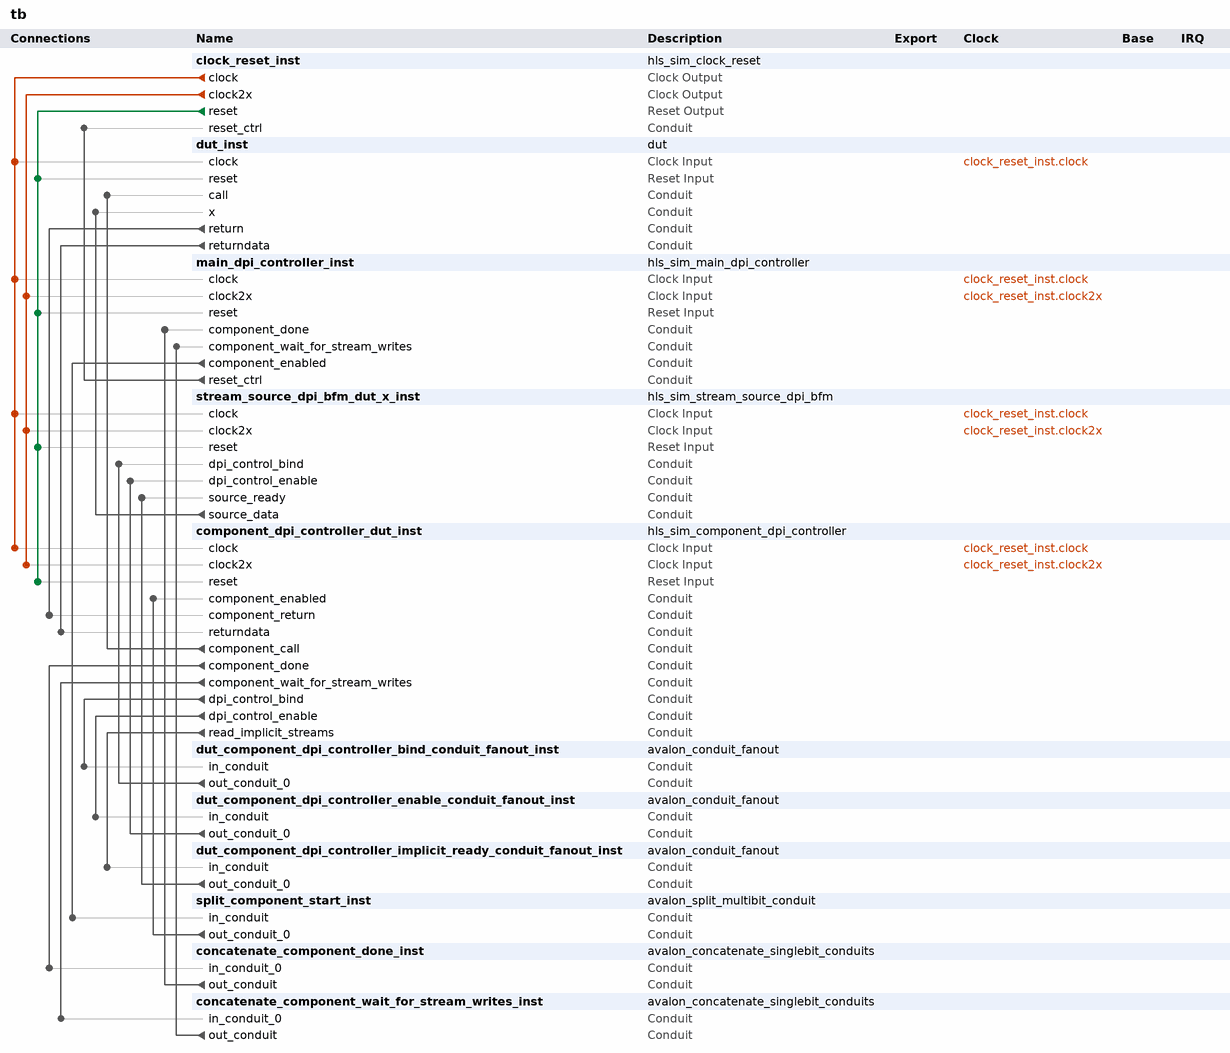
[diagram p0: system contents]
# Platform Designer (Qsys) system tb, Cyclone V 5CGXFC3B6F23C6
# Parameters at their usual value, and those the tool derives, are not listed.
package require qsys
create_system tb
set_project_property DEVICE_FAMILY {Cyclone V}
set_project_property DEVICE 5CGXFC3B6F23C6

add_instance clock_reset_inst hls_sim_clock_reset 1.0
set_instance_parameter_value clock_reset_inst RESET_CYCLE_HOLD 4

add_instance dut_inst dut 1.0

add_instance main_dpi_controller_inst hls_sim_main_dpi_controller 1.0
set_instance_parameter_value main_dpi_controller_inst COMPONENT_NAMES_STR dut
set_instance_parameter_value main_dpi_controller_inst NUM_COMPONENTS 1

add_instance stream_source_dpi_bfm_dut_x_inst hls_sim_stream_source_dpi_bfm 1.0
set_instance_parameter_value stream_source_dpi_bfm_dut_x_inst COMPONENT_NAME dut
set_instance_parameter_value stream_source_dpi_bfm_dut_x_inst EMPTY_WIDTH 0
set_instance_parameter_value stream_source_dpi_bfm_dut_x_inst FIRST_SYMBOL_IN_HIGH_ORDER_BITS 0
set_instance_parameter_value stream_source_dpi_bfm_dut_x_inst FORCE_STREAM_CONDUIT 1
set_instance_parameter_value stream_source_dpi_bfm_dut_x_inst INTERFACE_NAME x
set_instance_parameter_value stream_source_dpi_bfm_dut_x_inst STREAM_BITSPERSYMBOL 1
set_instance_parameter_value stream_source_dpi_bfm_dut_x_inst STREAM_DATAWIDTH 16
set_instance_parameter_value stream_source_dpi_bfm_dut_x_inst USES_PACKETS 0

add_instance component_dpi_controller_dut_inst hls_sim_component_dpi_controller 1.0
set_instance_parameter_value component_dpi_controller_dut_inst COMPONENT_HAS_AGENT_RETURN 0
set_instance_parameter_value component_dpi_controller_dut_inst COMPONENT_MANGLED_NAME "\\3fdut@@YA\\3fAV\\3f\$ac_fixed@\$0BA@\$07\$00\$0A@\$0A@@@V1@@Z"
set_instance_parameter_value component_dpi_controller_dut_inst COMPONENT_NAME dut
set_instance_parameter_value component_dpi_controller_dut_inst COMPONENT_NUM_AGENTS 0
set_instance_parameter_value component_dpi_controller_dut_inst COMPONENT_NUM_OUTPUT_STREAMS 0
set_instance_parameter_value component_dpi_controller_dut_inst RETURN_DATAWIDTH 16

add_instance dut_component_dpi_controller_bind_conduit_fanout_inst avalon_conduit_fanout 1.0
set_instance_parameter_value dut_component_dpi_controller_bind_conduit_fanout_inst numFanOut 1

add_instance dut_component_dpi_controller_enable_conduit_fanout_inst avalon_conduit_fanout 1.0
set_instance_parameter_value dut_component_dpi_controller_enable_conduit_fanout_inst numFanOut 1

add_instance dut_component_dpi_controller_implicit_ready_conduit_fanout_inst avalon_conduit_fanout 1.0
set_instance_parameter_value dut_component_dpi_controller_implicit_ready_conduit_fanout_inst numFanOut 1

add_instance split_component_start_inst avalon_split_multibit_conduit 1.0
set_instance_parameter_value split_component_start_inst multibit_width 1

add_instance concatenate_component_done_inst avalon_concatenate_singlebit_conduits 1.0
set_instance_parameter_value concatenate_component_done_inst multibit_width 1

add_instance concatenate_component_wait_for_stream_writes_inst avalon_concatenate_singlebit_conduits 1.0
set_instance_parameter_value concatenate_component_wait_for_stream_writes_inst multibit_width 1

# connections
add_connection clock_reset_inst.clock component_dpi_controller_dut_inst.clock clock
add_connection clock_reset_inst.clock dut_inst.clock clock
add_connection clock_reset_inst.clock main_dpi_controller_inst.clock clock
add_connection clock_reset_inst.clock stream_source_dpi_bfm_dut_x_inst.clock clock
add_connection clock_reset_inst.clock2x component_dpi_controller_dut_inst.clock2x clock
add_connection clock_reset_inst.clock2x main_dpi_controller_inst.clock2x clock
add_connection clock_reset_inst.clock2x stream_source_dpi_bfm_dut_x_inst.clock2x clock
add_connection clock_reset_inst.reset component_dpi_controller_dut_inst.reset reset
add_connection clock_reset_inst.reset dut_inst.reset reset
add_connection clock_reset_inst.reset main_dpi_controller_inst.reset reset
add_connection clock_reset_inst.reset stream_source_dpi_bfm_dut_x_inst.reset reset
add_connection component_dpi_controller_dut_inst.component_call dut_inst.call conduit
add_connection component_dpi_controller_dut_inst.component_done concatenate_component_done_inst.in_conduit_0 conduit
add_connection component_dpi_controller_dut_inst.component_wait_for_stream_writes concatenate_component_wait_for_stream_writes_inst.in_conduit_0 conduit
add_connection component_dpi_controller_dut_inst.dpi_control_bind dut_component_dpi_controller_bind_conduit_fanout_inst.in_conduit conduit
add_connection component_dpi_controller_dut_inst.dpi_control_enable dut_component_dpi_controller_enable_conduit_fanout_inst.in_conduit conduit
add_connection component_dpi_controller_dut_inst.read_implicit_streams dut_component_dpi_controller_implicit_ready_conduit_fanout_inst.in_conduit conduit
add_connection concatenate_component_done_inst.out_conduit main_dpi_controller_inst.component_done conduit
add_connection concatenate_component_wait_for_stream_writes_inst.out_conduit main_dpi_controller_inst.component_wait_for_stream_writes conduit
add_connection dut_component_dpi_controller_bind_conduit_fanout_inst.out_conduit_0 stream_source_dpi_bfm_dut_x_inst.dpi_control_bind conduit
add_connection dut_component_dpi_controller_enable_conduit_fanout_inst.out_conduit_0 stream_source_dpi_bfm_dut_x_inst.dpi_control_enable conduit
add_connection dut_component_dpi_controller_implicit_ready_conduit_fanout_inst.out_conduit_0 stream_source_dpi_bfm_dut_x_inst.source_ready conduit
add_connection dut_inst.return component_dpi_controller_dut_inst.component_return conduit
add_connection dut_inst.returndata component_dpi_controller_dut_inst.returndata conduit
add_connection main_dpi_controller_inst.component_enabled split_component_start_inst.in_conduit conduit
add_connection main_dpi_controller_inst.reset_ctrl clock_reset_inst.reset_ctrl conduit
add_connection split_component_start_inst.out_conduit_0 component_dpi_controller_dut_inst.component_enabled conduit
add_connection stream_source_dpi_bfm_dut_x_inst.source_data dut_inst.x conduit

set_interconnect_requirement {$system} qsys_mm.clockCrossingAdapter HANDSHAKE
set_interconnect_requirement {$system} qsys_mm.enableEccProtection FALSE
set_interconnect_requirement {$system} qsys_mm.insertDefaultSlave FALSE
set_interconnect_requirement {$system} qsys_mm.maxAdditionalLatency 1

save_system tb.qsys
